# EAGLE design fpc-30-lcd-adapter (EAGLE 9.6.2)
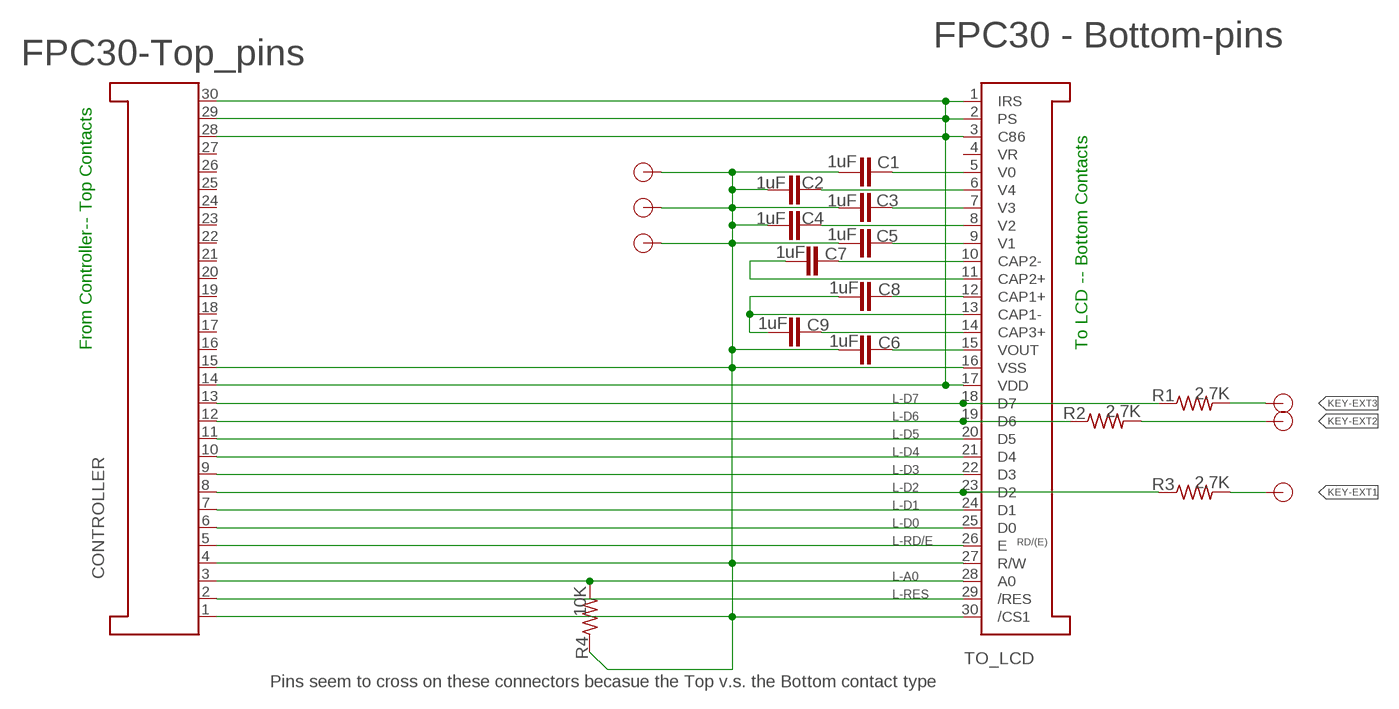
[diagram p0: schematic, sheet 1]

## Parts
C1  1uF  C-EUC0805  [C0805]
C2  1uF  C-EUC0805  [C0805]
C3  1uF  C-EUC0805  [C0805]
C4  1uF  C-EUC0805  [C0805]
C5  1uF  C-EUC0805  [C0805]
C6  1uF  C-EUC0805  [C0805]
C7  1uF  C-EUC0805  [C0805]
C8  1uF  C-EUC0805  [C0805]
C9  1uF  C-EUC0805  [C0805]
CONTROLLER  FPC30-Top_pins  FPC_30-PINS  [FH12-30S-0.5SH]
EXT1  TP-1  [TP]
EXT2  TP-1  [TP]
EXT3  TP-1  [TP]
K_EXT4  TP-1  [TP]
K_EXT5  TP-1  [TP]
K_EXT6  TP-1  [TP]
R1  2.7K  R-US_R0603  [R0603]
R2  2.7K  R-US_R0603  [R0603]
R3  2.7K  R-US_R0603  [R0603]
R4  10K  R-US_R0603  [R0603]
TO_LCD  FPC30 - Bottom-pins  FPC_30_ERC12864-2  [FH12-30S-0.5SH]

## Nets
KEY-EXT1: EXT1.P$1 R3.2
KEY-EXT2: EXT2.P$1 R2.2
KEY-EXT3: EXT3.P$1 R1.2
L-A0: CONTROLLER.3 R4.2 TO_LCD.28(A0)
L-D0: CONTROLLER.6 TO_LCD.25(D0)
L-D1: CONTROLLER.7 TO_LCD.24(D1)
L-D2: CONTROLLER.8 R3.1 TO_LCD.23(D2)
L-D3: CONTROLLER.9 TO_LCD.22(D3)
L-D4: CONTROLLER.10 TO_LCD.21(D4)
L-D5: CONTROLLER.11 TO_LCD.20(D5)
L-D6: CONTROLLER.12 R2.1 TO_LCD.19(D6)
L-D7: CONTROLLER.13 R1.1 TO_LCD.18(D7)
L-RD/E: CONTROLLER.5 TO_LCD.26(E)
L-RES: CONTROLLER.2 TO_LCD.29(/RES)
L_GND: C1.2 C2.2 C3.2 C4.2 C5.2 C6.2 CONTROLLER.1 CONTROLLER.4 CONTROLLER.15 K_EXT4.P$1 K_EXT5.P$1 K_EXT6.P$1 R4.1 TO_LCD.16(VSS) TO_LCD.27(R/W) TO_LCD.30(/CS1)
L_VDD: CONTROLLER.14 CONTROLLER.28 CONTROLLER.29 CONTROLLER.30 TO_LCD.1(IRS) TO_LCD.2(PS) TO_LCD.3(C86) TO_LCD.17(VDD)
N$3: C1.1 TO_LCD.5(V0)
N$4: C2.1 TO_LCD.6(V4)
N$5: C3.1 TO_LCD.7(V3)
N$6: C4.1 TO_LCD.8(V2)
N$7: C5.1 TO_LCD.9(V1)
N$9: C7.1 TO_LCD.10(CAP2-)
N$10: C7.2 TO_LCD.11(CAP2+)
N$11: C8.2 C9.2 TO_LCD.13(CAP1-)
N$12: C8.1 TO_LCD.12(CAP1+)
N$14: C9.1 TO_LCD.14(CAP3+)
N$15: C6.1 TO_LCD.15(VOUT)
Unconnected: CONTROLLER.16 CONTROLLER.17 CONTROLLER.18 CONTROLLER.19 CONTROLLER.20 CONTROLLER.21 CONTROLLER.22 CONTROLLER.23 CONTROLLER.24 CONTROLLER.25 CONTROLLER.26 CONTROLLER.27 TO_LCD.4(VR)

## Notes on the sheet
- From Controller-- Top Contacts | To LCD -- Bottom Contacts
- RD/(E)
- Pins seem to cross on these connectors becasue the Top v.s. the Bottom contact type

## Library data of the parts
C1-C9 = rcl:C-EU: CAPACITOR, European symbol; SPICEPREFIX: C
CONTROLLER = XP9300:FPC_30-PINS; DIGIKEY: 732-3517-ND
EXT1-EXT3 K_EXT4-K_EXT6 = XP9300:TP-1
R1-R4 = rcl:R-US_: RESISTOR, American symbol; SPICEPREFIX: R
TO_LCD = XP9300:FPC_30_ERC12864-2: 0.5mm Pitch Connectors For FPC/FFC Source: Data sheet <http://www.hirose.co.jp/cataloge_hp/e58605370.pdf>; DIGIKEY: 732-3518-ND; VALUE: ERC12864-2

## Board
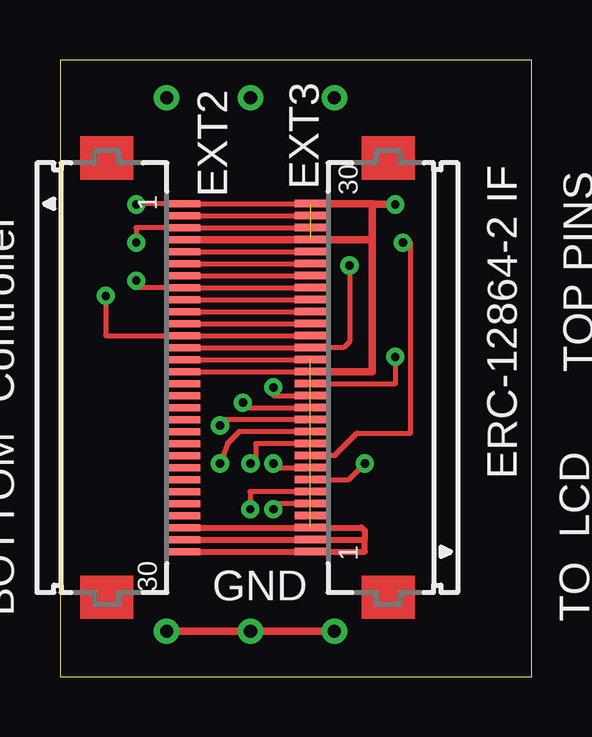
[diagram p1: board, top side]
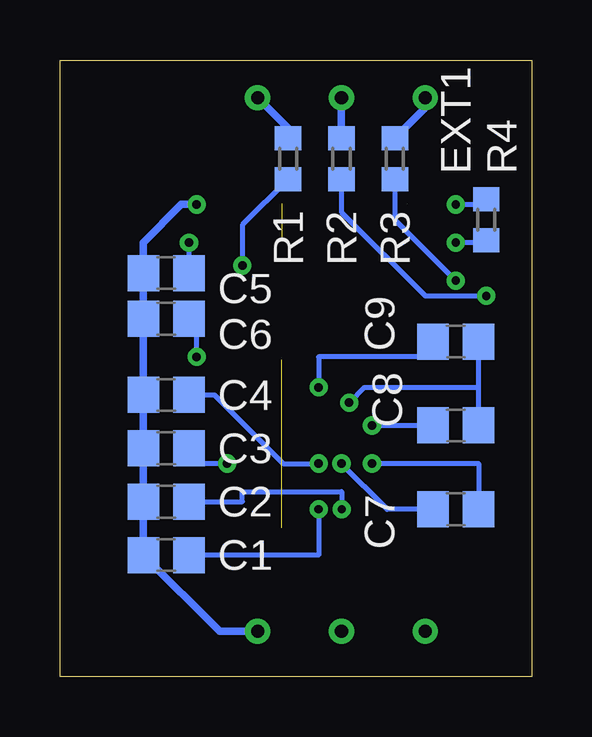
[diagram p2: board, bottom side, seen from below]

Size 19.67 x 25.7 mm. Coordinates in mm from the lower left corner, seen from the top.
Outline: 0,0 19.67,0 19.67,25.7 0,25.7 0,0
Copper layers (1*16): Top 0.035mm / dielectric 1.5mm / Bottom 0.035mm
Design rules "default": minimum track width 6mil, minimum drill 0.35mm, track to track 6mil, track to pad 6mil, pad to pad 6mil, via to via 6mil, smd to smd 6mil, copper to edge 40mil, drill to drill 6mil, minimum pad ring 10mil, minimum via ring 8mil, stop-mask expansion 4mil, vias tented up to drill 0mil, thermal gap 10mil

### Footprints (pad centres in the part's own frame; a part is rotated, then mirrored left to right if it is on the bottom)
C0805 = smd 1.3 x 1.5: 1 -0.95,0; 2 0.95,0
FH12-30S-0.5SH = smd 0.3 x 1.3: 1 -7.02,2.66; 2 -6.52,2.66; 3 -6.02,2.66; 4 -5.52,2.66; 5 -5.02,2.66; 6 -4.52,2.66; 7 -4.02,2.66; 8 -3.52,2.66; 9 -3.02,2.66; 10 -2.52,2.66; 11 -2.02,2.66; 12 -1.52,2.66; 13 -1.02,2.66; 14 -0.52,2.66; 15 -0.02,2.66; 16 0.48,2.66; 17 0.98,2.66; 18 1.48,2.66; 19 1.98,2.66; 20 2.48,2.66; 21 2.98,2.66; 22 3.48,2.66; 23 3.98,2.66; 24 4.48,2.66; 25 4.98,2.66; 26 5.48,2.66; 27 5.98,2.66; 28 6.48,2.66; 29 6.98,2.66; 30 7.48,2.66
TP = drill 0.55: P$1 0,0
R0603 = smd 1 x 1.1: 1 -0.85,0; 2 0.85,0

### Placement (x,y rotation side)
C1  15.24,5.08 180 bottom
C2  15.24,7.3 180 bottom
C3  15.24,9.53 180 bottom
C4  15.24,11.75 180 bottom
C5  15.24,16.83 180 bottom
C6  15.24,14.92 180 bottom
C7  3.18,6.99 0 bottom
C8  3.18,10.48 0 bottom
C9  3.18,13.97 0 bottom
CONTROLLER  2.54,12.7 270 top
EXT1  4.45,24.13 0 top
EXT2  7.94,24.13 0 top
EXT3  11.43,24.13 0 top
K_EXT4  4.45,1.91 0 top
K_EXT5  7.94,1.91 0 top
K_EXT6  11.43,1.91 0 top
R1  10.16,21.59 90 bottom
R2  7.94,21.59 90 bottom
R3  5.71,21.59 90 bottom
R4  1.9,19.05 270 bottom
TO_LCD  13.08,12.24 90 top

### Tracks (layer width: path | path; a pad name or v marks a point on that pad's centre or on a via)
KEY-EXT1
  Bottom 0.305: R3.2 4.45,23.71 EXT1.P$1
KEY-EXT2
  Bottom 0.305: R2.2 EXT2.P$1
KEY-EXT3
  Bottom 0.305: R1.2 10.16,22.86 EXT3.P$1
L-A0  (via drill 0.35)
  Top 0.203: TO_LCD.28 CONTROLLER.3 3.18,18.72 v3.18,18.1
  Bottom 0.203: R4.2 1.9,18.1 v3.18,18.1
L-D0
  Top 0.203: CONTROLLER.6 TO_LCD.25
L-D1
  Top 0.203: CONTROLLER.7 TO_LCD.24
L-D2  (via drill 0.35)
  Top 0.203: TO_LCD.23 CONTROLLER.8 3.18,16.22 v3.18,16.51
  Bottom 0.203: R3.1 5.71,19.05 v3.18,16.51
L-D3
  Top 0.203: CONTROLLER.9 TO_LCD.22
L-D4
  Top 0.203: CONTROLLER.10 TO_LCD.21
L-D5
  Top 0.203: CONTROLLER.11 TO_LCD.20
L-D6  (via drill 0.35)
  Top 0.203: TO_LCD.19 CONTROLLER.12 1.9,14.22 v1.9,15.88
  Bottom 0.203: R2.1 7.94,19.37 4.45,15.88 v1.9,15.88
L-D7  (via drill 0.35)
  Top 0.203: CONTROLLER.13 TO_LCD.18 | TO_LCD.18 | v12.06,17.14 12.06,13.97 11.81,13.72 TO_LCD.18
  Bottom 0.203: R1.1 12.06,18.84 v12.06,17.14
L-RD/E
  Top 0.203: CONTROLLER.5 TO_LCD.26
L-RES
  Top 0.203: CONTROLLER.2 TO_LCD.29
L_GND  (via drill 0.35)  (2 unrouted)
  Top 0.203: TO_LCD.16 CONTROLLER.15 5.18,12.7 | CONTROLLER.1 TO_LCD.30 | TO_LCD.27 | 13.02,19.68 13.02,19.72 | CONTROLLER.1 3.18,19.72 v3.18,19.68
  Top 0.305: CONTROLLER.4 13.02,18.22 | 13.02,19.72 TO_LCD.30 | 13.02,18.22 13.02,19.68 v13.97,19.68 | TO_LCD.16 13.02,12.72 13.02,18.22 | K_EXT4.P$1 K_EXT5.P$1 K_EXT6.P$1
  Bottom 0.203: v3.18,19.68 1.9,19.68 R4.1
  Bottom 0.305: v13.97,19.68 14.6,19.68 16.19,18.1 C5.2 C6.2 C4.2 C3.2 C2.2 C1.2 13.01,1.91 K_EXT6.P$1
L_VDD  (1 unrouted)
  Top 0.203: CONTROLLER.14 TO_LCD.17 | TO_LCD.1 | TO_LCD.3 | TO_LCD.2
  Top 0.254: CONTROLLER.30 TO_LCD.1 | CONTROLLER.29 TO_LCD.2 | CONTROLLER.28 TO_LCD.3 | TO_LCD.3 12.57,6.22 12.7,6.1 12.7,5.72 | TO_LCD.1 12.7,5.22 12.7,5.72 | TO_LCD.2 12.7,5.72
N$3  (via drill 0.35)
  Top 0.203: TO_LCD.5 8.89,7.22 v8.89,6.99
  Bottom 0.203: v8.89,6.99 8.89,5.08 C1.1
N$4  (via drill 0.35)
  Top 0.203: TO_LCD.6 7.93,7.72 v7.93,6.99
  Bottom 0.203: C2.1 14.29,7.94 | C2.1 14.29,7.72 | C2.1 12.06,7.3 12.06,7.72 7.93,7.72 v7.93,6.99
N$5  (via drill 0.35)
  Top 0.203: TO_LCD.7 12.03,8.22 v12.7,8.89
  Bottom 0.203: C3.1 13.65,8.89 v12.7,8.89
N$6  (via drill 0.35)
  Top 0.203: v8.89,8.89 9.06,8.72 TO_LCD.8
  Bottom 0.203: v8.89,8.89 10.37,8.89 13.23,11.75 C4.1
N$7  (via drill 0.35)
  Top 0.203: 11.48,9.22 11.43,9.22 | 11.43,9.22 TO_LCD.9 | 11.43,9.22 12.37,10.16 14.6,10.16 14.6,18.1 v14.29,18.1
  Bottom 0.203: C5.1 v14.29,18.09 v14.29,18.1
N$9  (via drill 0.35)
  Top 0.203: TO_LCD.10 8.16,9.72 8.16,8.89 v7.94,8.89
  Bottom 0.203: C7.1 6.03,6.99 v7.94,8.89
N$10  (via drill 0.35)
  Top 0.203: v6.67,8.89 6.98,9.74 7.46,10.22 TO_LCD.11
  Bottom 0.203: C7.2 2.23,8.89 v6.67,8.89
N$11  (via drill 0.35)
  Top 0.203: v7.62,11.43 7.62,11.22 TO_LCD.13
  Bottom 0.203: C8.2 2.23,12.06 | 2.23,12.06 C9.2 | v7.62,11.43 6.98,12.06 2.23,12.06
N$12  (via drill 0.35)
  Top 0.203: TO_LCD.12 6.67,10.72 v6.67,10.48
  Bottom 0.203: 3.81,10.48 C8.1 v6.67,10.48
N$14  (via drill 0.35)
  Top 0.203: v8.89,12.06 8.89,11.72 TO_LCD.14
  Bottom 0.203: C9.1 4.12,13.34 8.89,13.34 v8.89,12.06
N$15  (via drill 0.35)
  Top 0.203: TO_LCD.15 13.97,12.22 v13.97,13.34
  Bottom 0.203: v13.97,13.34 13.97,14.6 C6.1

### Text on the board
tPlace: TOP PINS | Controller | ERC-12864-2 IF | BOTTOM | GND